# EAGLE design E-fliteACCharger (EAGLE 5.06)
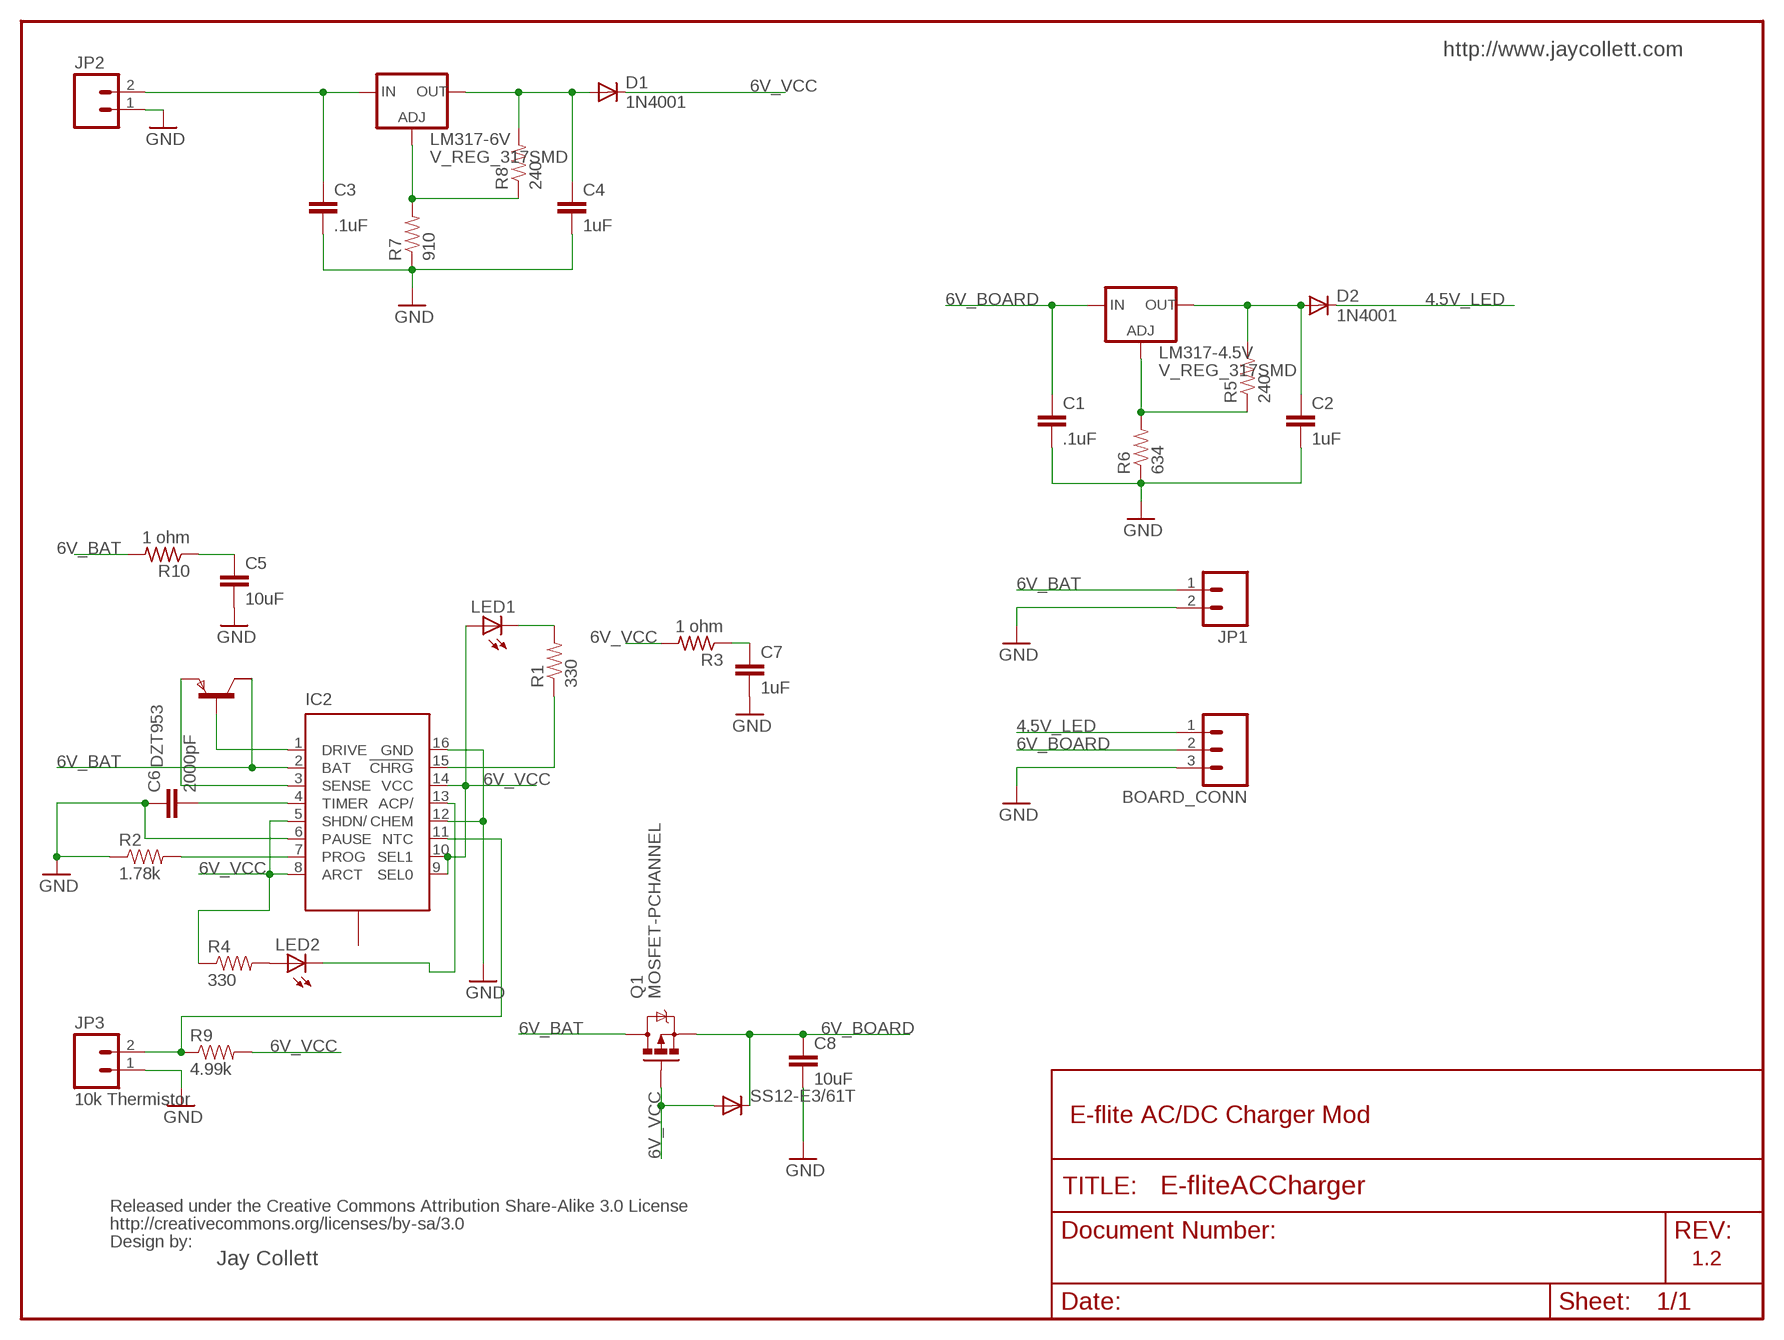
[diagram p0: schematic, sheet 1]

## Parts
BOARD_CONN  M03LOCK  [1X03_LOCK]
C1  .1uF  CAP0603-CAP  [0603-CAP]
C2  1uF  CAP0805  [0805]
C3  .1uF  CAP0603-CAP  [0603-CAP]
C4  1uF  CAP0805  [0805]
C5  10uF  CAP0805  [0805]
C6  2000pF  CAP0805  [0805]
C7  1uF  CAP0805  [0805]
C8  10uF  CAP0805  [0805]
D1  1N4001  DIODEPTH  [DIODE-1N4001]
D2  1N4001  DIODEPTH  [DIODE-1N4001]
DZT953  PNPSOT223  [SOT223]
IC2  LTC4060FEFE  [TSSOP16-PAD]
JP1  M02LOCK  [1X02_LOCK]
JP2  M02LOCK  [1X02_LOCK]
JP3  10k Thermistor  M02LOCK  [1X02_LOCK]
LED1  LED3MM  [LED3MM]
LED2  LED0603  [LED-0603]
LM317-4.5V  V_REG_317SMD  [SOT223]
LM317-6V  V_REG_317SMD  [SOT223]
Q1  MOSFET-PCHANNEL  [SOT23]
R1  330  RESISTOR  [0805]
R2  1.78k  RESISTOR1206  [1206]
R3  1 ohm  R-US_R0805  [R0805]
R4  330  RESISTOR  [0805]
R5  240  RESISTOR1206  [1206]
R6  634  RESISTOR1206  [1206]
R7  910  RESISTOR1206  [1206]
R8  240  RESISTOR1206  [1206]
R9  4.99k  RESISTOR1206  [1206]
R10  1 ohm  R-US_R0805  [R0805]
SS12-E3/61T  DIODESMA  [SMA-DIODE]
U$6  CREATIVE_COMMONS  [CREATIVE_COMMONS]

## Nets
4.5V_LED: BOARD_CONN.1 D2.C
6V_BAT: DZT953.4(C1) IC2.2(BAT) JP1.1 Q1.3(D) R10.2
6V_BOARD: BOARD_CONN.2 C1.1 C8.1 LM317-4.5V.3(IN) Q1.2(S) SS12-E3/61T.C
6V_VCC: D1.C IC2.5(SHDN/) IC2.8(ARCT) IC2.9(SEL0) IC2.10(SEL1) IC2.14(VCC) LED1.A Q1.1(G) R3.2 R4.1 R9.2 SS12-E3/61T.A
GND: BOARD_CONN.3 C1.2 C2.2 C3.2 C4.2 C5.2 C6.1 C7.2 C8.2 IC2.6(PAUSE) IC2.12(CHEM) IC2.16(GND) JP1.2 JP3.1 R2.1 R6.1 R7.1
N$1: JP2.1 ; supply symbol labelled GND
N$2: LM317-4.5V.1(ADJ) R5.1 R6.2
N$3: C4.1 D1.A LM317-6V.2(OUT) R8.2
N$4: C2.1 D2.A LM317-4.5V.2(OUT) R5.2
N$5: C3.1 JP2.2 LM317-6V.3(IN)
N$6: LED1.K(C) R1.2
N$7: IC2.15(!CHRG) R1.1
N$8: C6.2 IC2.4(TIMER)
N$9: IC2.7(PROG) R2.2
N$10: IC2.11(NTC) JP3.2 R9.1
N$11: LM317-6V.1(ADJ) R7.2 R8.1
N$12: DZT953.1(B) IC2.1(DRIVE)
N$13: IC2.13(ACP/) LED2.C
N$14: DZT953.3(E) IC2.3(SENSE)
N$15: LED2.A R4.2
N$16: C7.1 R3.1
N$17: C5.1 R10.1
Unconnected: DZT953.2(C)

## Notes on the sheet
- http://www.jaycollett.com
- E-flite AC/DC Charger Mod
- Jay Collett | 1.2

## Power pins joined to a net without a drawn wire
PAD: IC2.17(PAD)

## Library data of the parts
BOARD_CONN = SparkFun:M03: Header 3 Standard 3-pin 0.1" header. Use with straight break away headers (SKU : PRT-00116), right angle break away headers (PRT-00553), swiss pins (PRT-00743), machine pins (PRT-00117), and female headers (PRT-00115). Molex polarized connector foot print use with SKU : PRT-08232 with associated crimp pins and housings.
C1-C8 = SparkFun:CAP: Capacitor Standard 0603 ceramic capacitor, and 0.1" leaded capacitor.
D1 D2 SS12-E3/61T = SparkFun:DIODE: Diode These are standard reverse protection diodes and small signal diodes. SMA package can handle up to about 1A. SOD-323 can handle about 200mA. What the SOD-323 package when ordering, there are some mfgs out there that are 5-pin packages.
DZT953 = zetex:PNPSOT223: PNP TRANSISTOR
IC2 = linear-technology-3:LTC4060FE
JP1-JP3 = SparkFun:M02: Header 2 Standard 2-pin 0.1" header. Use with straight break away headers (SKU : PRT-00116), right angle break away headers (PRT-00553), swiss pins (PRT-00743), machine pins (PRT-00117), and female headers (PRT-00115). Molex polarized connector foot print use with SKU : PRT-08233 with associated crimp pins and housings.
LED1 LED2 = SparkFun:LED: LEDs Standard schematic elements and footprints for 5mm, 3mm, 1206, and 0603 sized LEDs. 5mm - Spark Fun Electronics SKU : COM-00529 (and others)
LM317-4.5V LM317-6V = SparkFun:V_REG_317: Voltage Regulator Standard LM317 adjustable voltage regulator. AOI (Adjust Output Input). Google 'LM317 Calculator' for easy to use app to get the two resistor values needed. 240/720 for 5V output. 240/390 for 3.3V output. Spark Fun Electronics SKU : COM-00527
Q1 = SparkFun:MOSFET-PCHANNEL
R1 R2 R4-R9 = SparkFun:RESISTOR: Resistor Basic schematic elements and footprints for 0603, 1206, and PTH 1/10th watt (small) resistors.
R3 R10 = resistor:R-US_: RESISTOR, American symbol
U$6 = SparkFun:CREATIVE_COMMONS

## Board
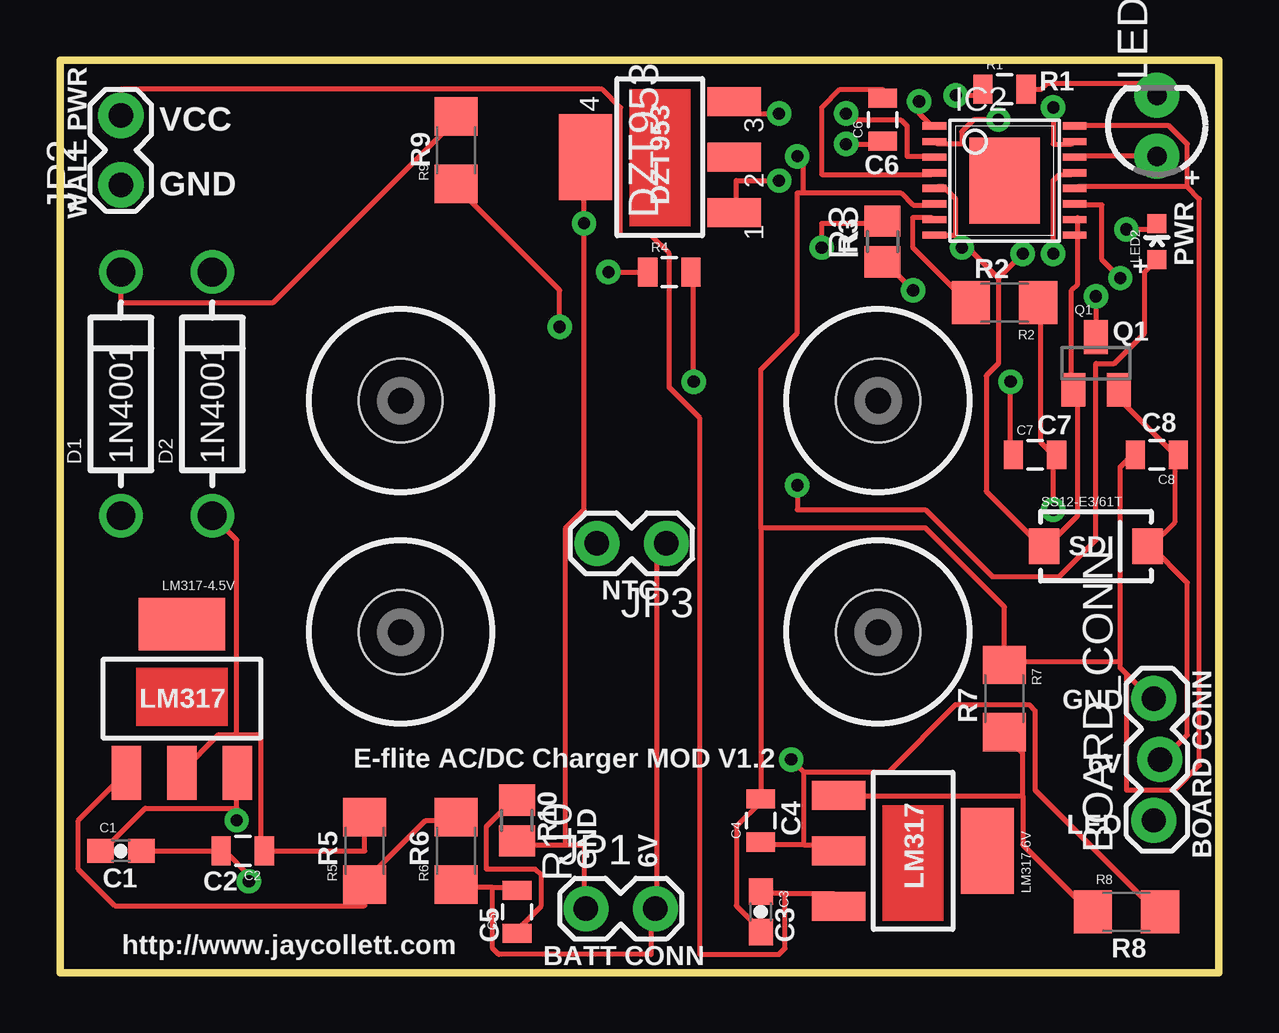
[diagram p1: board, top side]
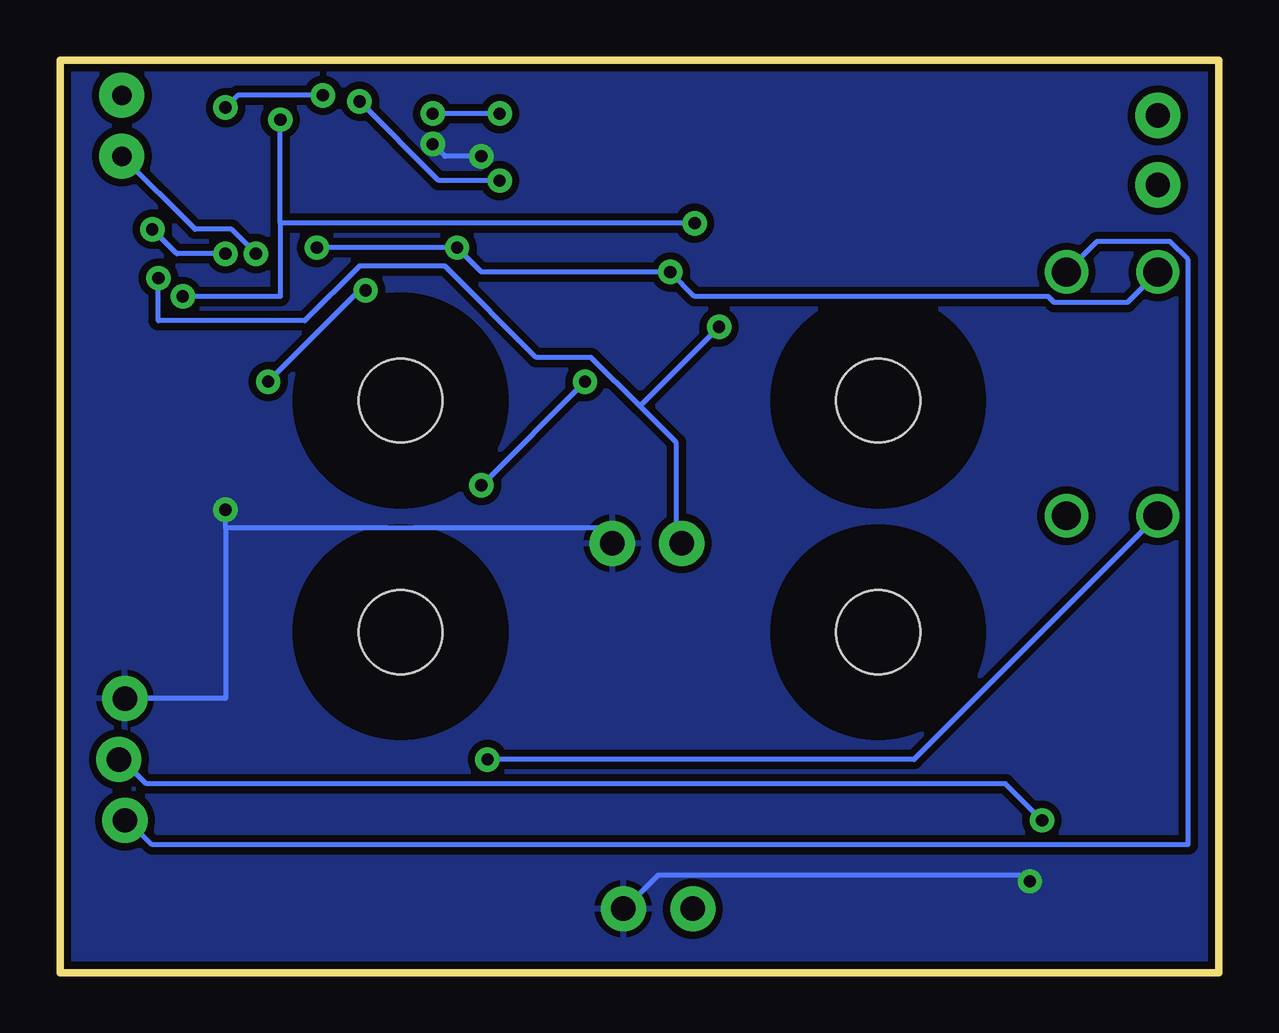
[diagram p2: board, bottom side, seen from below]

Size 48.3 x 38.05 mm. Coordinates in mm from the lower left corner, seen from the top.
Outline: 0,0 48.3,0 48.3,38.05 0,38.05 0,0
Copper layers (1*16): Top 0.035mm / dielectric 1.5mm / Bottom 0.035mm
Design rules "SparkFun": minimum track width 8mil, minimum drill 20mil, track to track 8mil, track to pad 8mil, pad to pad 8mil, via to via 8mil, smd to smd 8mil, copper to edge 10mil, drill to drill 8mil, minimum pad ring 12mil, minimum via ring 10mil, stop-mask expansion 4mil, vias tented up to drill 25mil, thermal gap 10mil
tKeepout: area 12.1,12.1 to 36.2,25.9

### Footprints (pad centres in the part's own frame; a part is rotated, then mirrored left to right if it is on the bottom)
1X03_LOCK = drill 1.016 pad 1.88 round: 1 0,0.127; 2 2.54,-0.127; 3 5.08,0.127
0603-CAP = smd 1.1 x 1: 1 -0.85,0; 2 0.85,0
0805 = smd 0.8 x 1.2: 1 -0.9,0; 2 0.9,0
DIODE-1N4001 = drill 1.2 round: A -5.08,0; C 5.08,0
SOT223 = smd 1.219 x 2.235: 1 -2.311,-3.099; 2 0,-3.099; 3 2.311,-3.099 | smd 3.6 x 2.2: 4 0,3.099
TSSOP16-PAD = smd 0.305 x 0.991: 1 -2.275,-2.918; 2 -1.625,-2.918; 3 -0.975,-2.918; 4 -0.325,-2.918; 5 0.325,-2.918; 6 0.975,-2.918; 7 1.625,-2.918; 8 2.275,-2.918; 9 2.275,2.918; 10 1.625,2.918; 11 0.975,2.918; 12 0.325,2.918; 13 -0.325,2.918; 14 -0.975,2.918; 15 -1.625,2.918; 16 -2.275,2.918 | smd 3.58 x 2.94: 17 0,0
1X02_LOCK = drill 1.016 pad 1.88 round: 1 -0.178,0; 2 2.718,0
LED3MM = drill 0.813 pad 1.88 round: A -1.27,0; K 1.27,0
LED-0603 = smd 0.8 x 0.8: A 0,-0.75; C 0,0.75
SOT23 = smd 1 x 1.4: 1 -0.95,-1.1; 2 0.95,-1.1; 3 0,1.1
1206 = smd 1.6 x 1.8: 1 -1.4,0; 2 1.4,0
R0805 = smd 1.3 x 1.5: 1 -0.85,0; 2 0.85,0
SMA-DIODE = smd 1.27 x 1.47: A -2.15,0; C 2.15,0
DRIL-3,5 = hole 3.5: 0,0

### Placement (x,y rotation side)
BOARD_CONN  45.72,6.35 90 top
C1  2.54,5.08 0 top
C2  7.62,5.08 180 top
C3  29.21,2.54 270 top
C4  29.21,6.35 90 top
C5  19.05,2.54 90 top
C6  34.29,35.56 90 top
C7  40.64,21.59 0 top
C8  45.72,21.59 180 top
D1  2.54,24.13 90 top
D2  6.35,24.13 90 top
DZT953  25,34 90 top
IC2  39.37,33.02 270 top
JP1  22.1,2.67 0 top
JP2  2.54,33.02 90 top
JP3  25.1,17.9 180 top
LED1  45.72,35.31 90 top
LED2  45.72,30.48 0 top
LM317-4.5V  5.08,11.43 0 top
LM317-6V  35.56,5.08 270 top
Q1  43.18,25.4 0 top
R1  39.37,36.83 0 top
R2  39.37,27.94 180 top
R3  34.29,30.48 90 top
R4  25.4,29.21 0 top
R5  12.7,5.08 90 top
R6  16.51,5.08 90 top
R7  39.37,11.43 270 top
R8  44.45,2.54 0 top
R9  16.51,34.29 90 top
R10  19.05,6.35 270 top
SS12-E3/61T  43.18,17.78 0 top
U$2  [DRIL-3,5]  14.2,23.85 180 top
U$3  [DRIL-3,5]  34.1,14.2 180 top
U$4  [DRIL-3,5]  34.1,23.85 180 top
U$5  [DRIL-3,5]  14.2,14.2 180 top
U$6  13.97,24.13 0 top

### Tracks (layer width: path | path; a pad name or v marks a point on that pad's centre or on a via)
4.5V_LED
  Bottom 0.203: D2.C 5.08,30.48 2.03,30.48 1.27,29.72 1.27,5.33 44.45,5.33 45.47,6.35 BOARD_CONN.1
6V_BAT  (via drill 0.51)
  Top 0.203: v39.12,35.56 38.1,35.56 37.59,35.05 37.59,34.54 36.58,34.54 IC2.2 | v43.18,28.19 Q1.3 | 21.08,5.33 21.84,5.33 21.84,2.79 JP1.1 | 21.08,5.33 19.05,5.33 R10.2 | 21.08,5.33 21.08,18.54 21.84,19.3 v21.84,31.24 21.84,33.78 DZT953.4
  Bottom 0.203: 39.12,31.24 39.12,28.19 v43.18,28.19 | 39.12,31.24 v39.12,35.56 | v21.84,31.24 39.12,31.24
6V_BOARD  (via drill 0.51)
  Top 0.203: 7.37,6.86 3.56,6.86 1.78,5.08 C1.1 | 7.37,6.86 7.37,8.13 LM317-4.5V.3 | 46.48,21.59 44.2,23.88 44.2,24.13 Q1.2 | 45.47,17.78 46.48,18.8 46.48,21.59 | 46.48,21.59 C8.1 | 45.47,17.78 46.99,16.26 46.99,9.91 45.97,8.89 BOARD_CONN.2 | 45.47,17.78 SS12-E3/61T.C | 7.37,6.86 v7.37,6.35
  Bottom 0.203: v7.37,6.35 8.89,7.87 44.7,7.87 45.72,8.89 BOARD_CONN.2
6V_VCC  (via drill 0.51)
  Top 0.203: LED1.A 42.42,34.04 IC2.14 | 37.34,30.73 36.58,30.73 IC2.8 | 37.34,30.73 37.34,32.26 36.83,32.77 36.58,32.77 IC2.5 | 42.42,30.73 42.42,31.5 IC2.10 | 42.42,30.73 42.42,28.7 42.16,28.45 42.16,24.38 Q1.1 42.42,24.13 42.42,19.05 41.15,17.78 SS12-E3/61T.A 40.89,17.78 38.61,20.07 38.61,24.89 39.12,25.4 39.12,28.96 | 42.42,30.73 IC2.9 | 37.85,30.23 39.12,28.96 | 37.85,30.23 37.34,30.73 | 39.12,28.96 v40.13,29.97 | v22.86,29.21 R4.1 | v31.75,30.23 31.75,31.24 34.29,31.24 R3.2 | D1.C 2.54,27.94 8.89,27.94 16.51,35.56 R9.2 | v37.59,30.23 37.85,30.23
  Bottom 0.203: LED1.A 42.67,30.99 41.15,30.99 v40.13,29.97 | D1.C 3.81,27.94 6.86,27.94 7.11,28.19 21.84,28.19 v22.86,29.21 30.73,29.21 v31.75,30.23 v37.59,30.23
GND  (via drill 0.51)
  Top 0.203: 30.99,32.51 30.73,32.51 30.73,26.67 29.21,25.15 29.21,18.54 | 30.99,32.51 35.05,32.51 35.56,32 36.32,32 IC2.6 | 29.21,18.54 C4.2 29.21,7.11 28.19,6.1 28.19,2.79 29.21,1.78 C3.2 | v32.77,34.54 34.29,34.54 C6.1 | v30.73,34.04 30.99,33.78 30.99,32.51 | 41.4,21.59 40.89,22.1 40.89,27.94 R2.1 | 46.99,32.77 42.42,32.77 IC2.12 | 46.99,32.77 46.99,34.54 46.23,35.31 42.42,35.31 IC2.16 | 44.2,12.95 44.2,12.7 44.45,12.45 | 44.2,12.95 44.2,21.08 44.7,21.59 C8.2 | 44.45,12.45 45.47,11.43 BOARD_CONN.3 | 44.2,12.95 39.37,12.95 | 46.99,32.77 47.5,32.26 47.5,8.64 46.48,7.62 44.45,7.62 44.45,12.45 | v41.4,19.3 41.4,21.59 | 41.4,21.59 C7.2 | 18.03,3.56 16.51,3.56 R6.1 | 18.03,3.56 19.05,3.56 C5.2 | C1.2 C2.2 6.86,5.08 7.87,4.06 v7.87,3.81 | 18.03,3.56 18.03,1.02 18.29,0.76 24.64,0.76 24.64,2.54 JP1.2 24.89,2.79 24.89,17.53 25.15,17.78 JP3.1 | 29.21,18.54 36.07,18.54 39.37,15.24 39.37,12.95 | 39.37,12.95 R7.1
  Bottom 0.203: v32.77,34.54 32.26,34.04 v30.73,34.04 | 41.4,18.54 41.4,11.43 BOARD_CONN.3 | 41.4,18.54 v41.4,19.3 | v7.87,3.81 8.13,4.06 23.37,4.06 24.64,2.79 JP1.2 | 41.4,18.54 25.91,18.54 25.4,18.03 JP3.1
  pour Bottom (isolate 0.305): 0,38.1 48.26,38.1 48.26,0 0,0
N$2
  Top 0.203: R6.2 16.51,6.35 15.24,6.35 12.7,3.81 R5.1 12.7,2.79 2.29,2.79 0.76,4.32 0.76,6.35 2.54,8.13 LM317-4.5V.1
N$3  (via drill 0.51)
  Top 0.203: 30.99,5.33 32.26,5.33 32.26,5.08 LM317-6V.2 | 30.99,5.33 29.21,5.33 C4.1 | 30.99,8.38 34.54,8.38 37.34,11.18 40.39,11.18 40.64,10.92 40.64,7.62 45.72,2.54 R8.2 | 30.99,8.38 30.99,5.33 | v30.48,8.89 30.99,8.38
  Bottom 0.203: D1.A 12.7,8.89 v30.48,8.89
N$4
  Top 0.203: R5.2 12.7,5.08 C2.1 8.38,5.08 8.38,9.91 7.37,9.91 | 7.37,9.91 6.6,9.91 5.08,8.38 LM317-4.5V.2 | D2.A 7.37,18.03 7.37,9.91
N$5
  Top 0.203: 30.23,3.3 32.26,3.3 32.26,2.79 LM317-6V.3 | 30.23,3.3 29.21,3.3 C3.1 | 30.23,3.3 30.23,1.02 29.97,0.76 26.67,0.76 26.67,23.11 25.4,24.38 25.4,29.97 24.64,30.73 23.37,30.73 23.37,36.07 22.61,36.83 2.54,36.83 JP2.2
N$6
  Top 0.203: LED1.K 45.72,37.08 41.15,37.08 40.89,36.83 R1.2
N$7  (via drill 0.51)
  Top 0.203: v41.4,36.07 41.4,34.54 42.16,34.54 IC2.15 | v37.34,36.58 38.35,36.58 38.35,36.83 R1.1
  Bottom 0.203: v41.4,36.07 40.89,36.58 v37.34,36.58
N$8
  Top 0.203: IC2.4 36.32,33.27 31.75,33.27 31.75,36.07 32.51,36.83 34.29,36.83 C6.2
N$9
  Top 0.203: IC2.7 36.32,31.5 35.56,31.5 35.56,30.23 37.85,27.94 R2.2
N$10  (via drill 0.51)
  Top 0.203: v44.2,28.96 43.43,29.72 43.43,32 42.42,32 IC2.11 | v20.83,26.92 20.83,28.45 16.51,32.77 R9.1
  Bottom 0.203: v44.2,28.96 44.2,27.18 38.1,27.18 35.81,29.46 32.26,29.46 28.45,25.65 26.16,25.65 24.13,23.62 | 24.13,23.62 22.61,22.1 22.61,18.03 JP3.2 | 24.13,23.62 v20.83,26.92
N$11
  Top 0.203: 40.13,7.37 40.13,9.14 39.37,9.91 R7.2 | 40.13,7.37 40.13,5.33 42.93,2.54 R8.1 | 40.13,7.37 32.51,7.37 LM317-6V.1
N$12  (via drill 0.51)
  Top 0.203: v35.81,36.32 35.81,35.81 36.32,35.31 IC2.1 | v29.97,33.02 28.19,33.02 28.19,31.75 DZT953.1
  Bottom 0.203: v35.81,36.32 32.51,33.02 v29.97,33.02
N$13  (via drill 0.51)
  Top 0.203: v44.45,30.99 45.72,30.99 LED2.C | v41.4,29.97 41.4,33.02 41.66,33.27 42.16,33.27 IC2.13
  Bottom 0.203: v44.45,30.99 43.43,29.97 v41.4,29.97
N$14  (via drill 0.51)
  Top 0.203: v32.77,35.81 32.77,35.56 35.05,35.56 35.31,35.31 35.31,34.04 36.32,34.04 IC2.3 | v29.97,35.81 28.19,35.81 28.19,36.07 DZT953.3
  Bottom 0.203: v29.97,35.81 v32.77,35.81
N$15  (via drill 0.51)
  Top 0.203: v30.73,20.32 30.73,19.3 36.07,19.3 38.86,16.51 41.66,16.51 43.18,18.03 43.18,25.4 43.94,25.4 45.21,26.67 45.21,29.21 45.72,29.72 LED2.A | v26.42,24.64 26.42,29.21 R4.2
  Bottom 0.203: v26.42,24.64 v30.73,20.32
N$16  (via drill 0.51)
  Top 0.203: v39.62,24.64 39.62,21.59 C7.1 | v35.56,28.45 34.29,29.72 R3.1
  Bottom 0.203: v39.62,24.64 35.81,28.45 v35.56,28.45
N$17
  Top 0.203: C5.1 19.05,1.78 20.07,2.79 20.07,4.06 19.81,4.32 17.78,4.32 17.78,6.1 19.05,7.37 R10.1
(copper drawn outside any net)
  shapes: Top area x3

### Text on the board
tPlace: R1 | VCC | R9 | C6 | + | GND | DZT953 | WALL PWR | R3 | R2 | + | PWR | Q1 | C8 | C7 | SDI | NTC | BOARD CONN | GND | LM317 | R7 | E-flite AC/DC Charger MOD V1.2 | 6V | LM317 | LED | C4 | R10 | C1 | R5 | R6 | GND | 6V | C2 | http://www.jaycollett.com | C5 | C3 | R8 | BATT CONN